# Altium project ESL_PCB_Project.PrjPCB
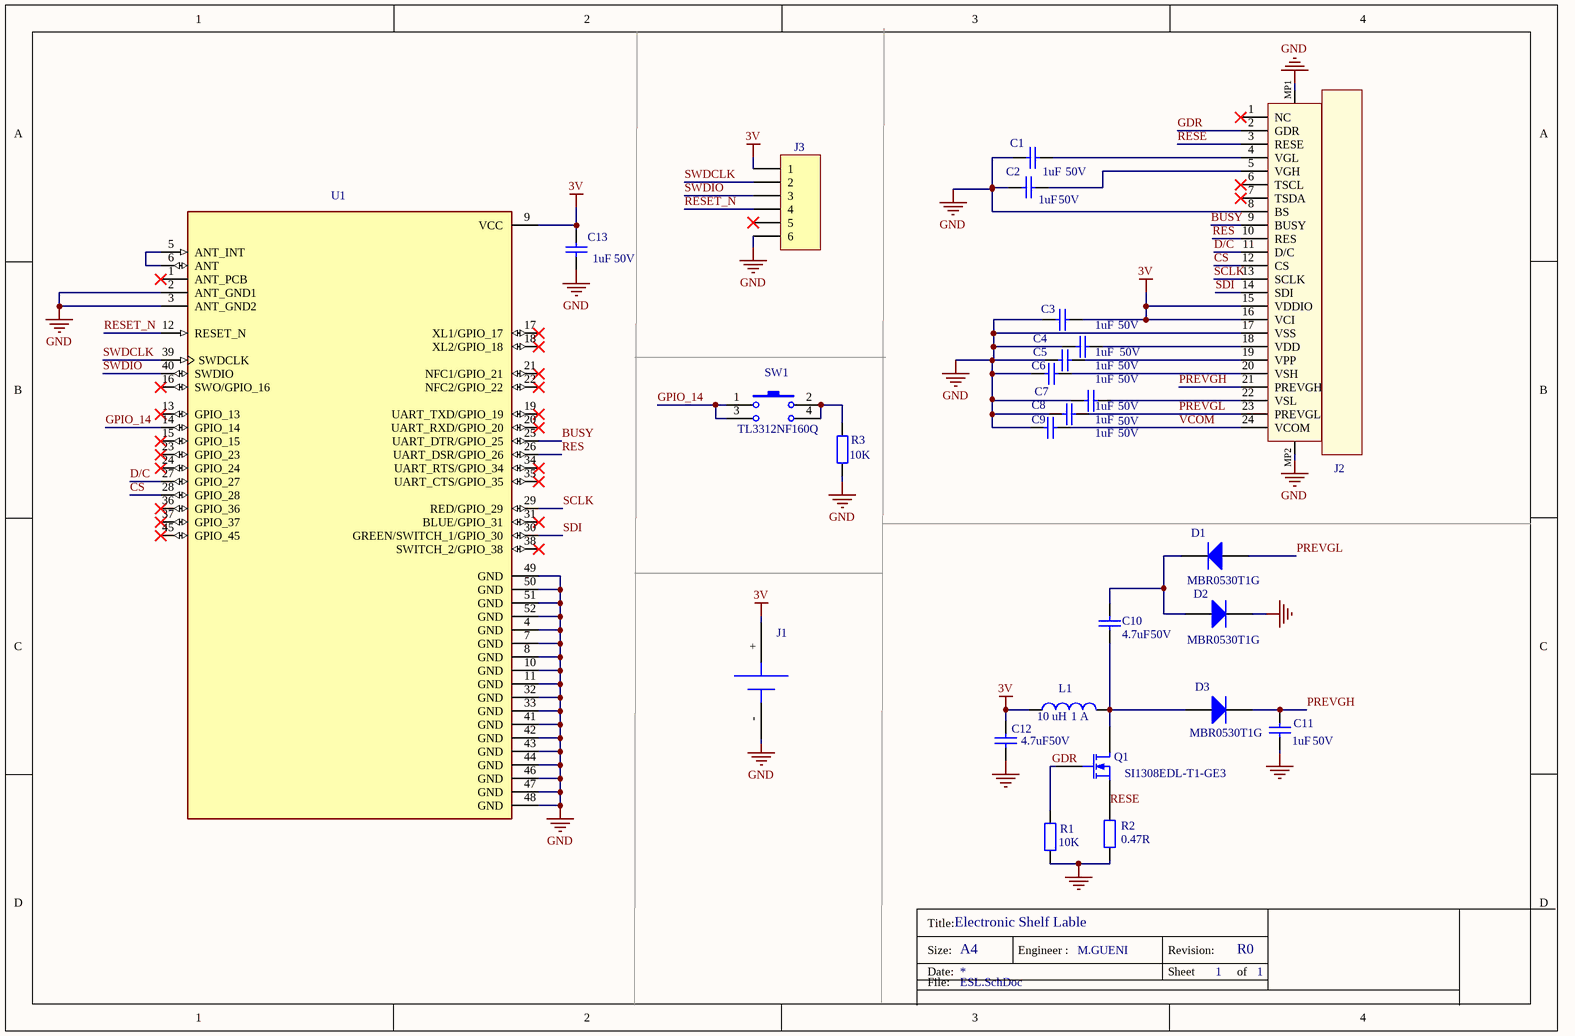
[diagram p0: ESL.SchDoc]
1 sheet, 26 parts. Net scope: global (net labels, ports and power ports of the same name join across sheets).
Board file: ESL.PcbDoc

## Sheet ESL.SchDoc
size A4; Organization: Micro Device Tunisie; Address1: Pépinière d’Entreprises Sousse-Tec; Address2: Espace Universitaire ISET SOUSSE; Address3: Cité Erriadh, 4023, Tunisia; Address4: contact@mdtunisie.com

### Parts
C1  Value 1: 1uF  Value 2: 50V  [CAPC1608N]  (hidden comment: Capacitor)
C2  Value 1: 1uF  Value 2: 50V  [CAPC1608N]  (hidden comment: Capacitor)
C3  Value 1: 1uF  Value 2: 50V  [CAPC1608N]  (hidden comment: Capacitor)
C4  Value 1: 1uF  Value 2: 50V  [CAPC1608N]  (hidden comment: Capacitor)
C5  Value 1: 1uF  Value 2: 50V  [CAPC1608N]  (hidden comment: Capacitor)
C6  Value 1: 1uF  Value 2: 50V  [CAPC1608N]  (hidden comment: Capacitor)
C7  Value 1: 1uF  Value 2: 50V  [CAPC1608N]  (hidden comment: Capacitor)
C8  Value 1: 1uF  Value 2: 50V  [CAPC1608N]  (hidden comment: Capacitor)
C9  Value 1: 1uF  Value 2: 50V  [CAPC1608N]  (hidden comment: Capacitor)
C10  Value 1: 4.7uF  Value 2: 50V  [CAPC2012N]  (hidden comment: Capacitor)
C11  Value 1: 1uF  Value 2: 50V  [CAPC1608N]  (hidden comment: Capacitor)
C12  Value 1: 4.7uF  Value 2: 50V  [CAPC2012N]  (hidden comment: Capacitor)
C13  Value 1: 1uF  Value 2: 50V  [CAPC1608N]  (hidden comment: Capacitor)
D1  MBR0530T1G  [DO-SOD-123]
D2  MBR0530T1G  [DO-SOD-123]
D3  MBR0530T1G  [DO-SOD-123]
J1  Battery_Holder  [Battery_Holder]  (value not drawn)
J2  WR-FPC  [WR-FPC-68712414022]  (value not drawn)
J3  282834-6  [282834-6]  (value not drawn)
L1  Value 1: 10 uH  Value 2: 1 A  [IND_2520]  (hidden comment: 1239AS-H-100M=P2)
Q1  SI1308EDL-T1-GE3  [MOS-SOT-323-3]
R1  Value 1: 10K  [RESC1608N]  (hidden comment: Resistor)
R2  Value 1: 0.47R  [RESC1608N]  (hidden comment: Resistor)
R3  Value 1: 10K  [RESC1608N]  (hidden comment: Resistor)
SW1  TL3312NF160Q  [SPST-TL3312NF160Q]
U1  ANNA-B112-01B  [ANNA-B112-01B]  (value not drawn)

### Nets
3V: C3.2 C12.2 C13.2 J1.+ J2.15(VDDIO) J2.16(VCI) J3.1 L1.1 U1.9(VCC)
GND: C1.1 C2.2 C3.1 C4.1 C5.1 C6.1 C7.1 C8.1 C9.1 C11.1 C12.1 C13.1 D2.2(K) J1.- J2.8(BS) J2.17(VSS) J2.MP1 J2.MP2 J3.6 R1.1 R2.1 R3.1 U1.2(ANT_GND1) U1.3(ANT_GND2) U1.4(GND) U1.7(GND) U1.8(GND) U1.10(GND) U1.11(GND) U1.32(GND) U1.33(GND) U1.41(GND) U1.42(GND) U1.43(GND) U1.44(GND) U1.46(GND) U1.47(GND) U1.48(GND) U1.49(GND) U1.50(GND) U1.51(GND) U1.52(GND)
BUSY: J2.9(BUSY) U1.25(UART_DTR/GPIO_25)
CS: J2.12(CS) U1.28(GPIO_28)
D/C: J2.11(D/C) U1.27(GPIO_27)
GDR: J2.2(GDR) Q1.1(G) R1.2
GPIO_14: SW1.1 SW1.3 U1.14(GPIO_14)
PREVGH: C11.2 D3.2(K) J2.21(PREVGH)
PREVGL: C8.2 D1.1(A) J2.23(PREVGL)
RES: J2.10(RES) U1.26(UART_DSR/GPIO_26)
RESE: J2.3(RESE) Q1.2(S) R2.2
RESET_N: J3.4 U1.12(RESET_N)
SCLK: J2.13(SCLK) U1.29(RED/GPIO_29)
SDI: J2.14(SDI) U1.30(GREEN/SWITCH_1/GPIO_30)
SWDCLK: J3.2 U1.39(SWDCLK)
SWDIO: J3.3 U1.40(SWDIO)
VCOM: C9.2 J2.24(VCOM)
NetC1_2: C1.2 J2.4(VGL)
NetC2_1: C2.1 J2.5(VGH)
NetC4_2: C4.2 J2.18(VDD)
NetC5_2: C5.2 J2.19(VPP)
NetC6_2: C6.2 J2.20(VSH)
NetC7_2: C7.2 J2.22(VSL)
NetC10_1: C10.1 D3.1(A) L1.2 Q1.3(D)
NetC10_2: C10.2 D1.2(K) D2.1(A)
NetR3_2: R3.2 SW1.2 SW1.4
NetU1_5: U1.5(ANT_INT) U1.6(ANT)

Not connected (* = marked no-connect by the designer): J2 1(NC)* 6(TSCL)* 7(TSDA)*; J3 5*; U1 1(ANT_PCB)* 13(GPIO_13)* 15(GPIO_15)* 16(SWO/GPIO_16)* 17(XL1/GPIO_17)* 18(XL2/GPIO_18)* 19(UART_TXD/GPIO_19)* 20(UART_RXD/GPIO_20)* 21(NFC1/GPIO_21)* 22(NFC2/GPIO_22)* 23(GPIO_23)* 24(GPIO_24)* 31(BLUE/GPIO_31)* 34(UART_RTS/GPIO_34)* 35(UART_CTS/GPIO_35)* 36(GPIO_36)* 37(GPIO_37)* 38(SWITCH_2/GPIO_38)* 45(GPIO_45)*

### Notes on the sheet
- Title:
- Size:
- Date:
- File:
- Electronic Shelf Lable
- A4
- Engineer :
- M.GUENI
- Revision:
- Sheet
- 1
- R0
- of

### Library data of the parts
C1-C9 C11 C13 = CAP-000000001: MAN: Taiyo Yuden; MANREF: UMK107BJ105KA-T; DES: Multilayer Ceramic Capacitors MLCC - SMD/SMT 1uF 50V X5R +/-10% 0603 Gen Purp; TOL: 10%; FTP: 0603; SUP: Mouser; SUPREF: 963-UMK107BJ105KA-T; NOTE: _; Part Number: CAP-000000001
C10 C12 = CAP-000000002: MAN: Murata Electronics; MANREF: GRM21BZ71H475KE15K; DES: Multilayer Ceramic Capacitors MLCC - SMD/SMT; TOL: 10%; FTP: 0805; SUP: Mouser; SUPREF: 81-GRM21BZ71H475KE5K; NOTE: _; Part Number: CAP-000000002
D1-D3 = DIR-000000001: Diode; MAN: ON Semiconductor; DES: Schottky Diodes & Rectifiers 0.5A 30V; Value 1: 500 mA; Value 2: 30 V; TOL: _; FTP: SOD-123; SUP: Mouser; SUPREF: 863-MBR0530T1G; Part Number: DIR-000000001; MANREF: MBR0530T1G; NOTE: _
J1 = CON-000000002: MAN: Keystone Electronics; MANREF: 3092; DES: Coin Cell Battery Holders 3012 matte Tin Coin Coin Cell Retainer; Value 1: _; Value 2: 16 mm; FTP: SMD/SMT; SUP: Mouser; SUPREF: 534-3092; Part Number: CON-000000002; TOL: _; NOTE: _
J2 = CON-000000001: MAN: Wurth Elektronik; MANREF: 68712414022; DES: FFC & FPC Connectors WR-FPC 0.5mm SMT ZIF 24Pin Hrztl Top Cont; Value 1: 24pts; Value 2: _; FTP: SMD/SMT; SUP: Mouser; SUPREF: 710-68712414022; ComponentLink1Description: Manufacturer; ComponentLink1URL: http://www.we-online.de; ComponentLink2Description: Datasheet; ComponentLink2URL: https://katalog.we-online.com/em/datasheet/68712414022.pdf; Part Number: CON-000000001; TOL: _; NOTE: _
J3 = CON-000000003: Header, 6-Pin; MAN: BUCHANAN - TE CONNECTIVITY; DES: 282834-6 -  Bornier fil-à-carte, 2.54 mm, 6 Voies, 30 AWG, 16 AWG, 1.4 mm², Par vis; Value 1: 6pts; Value 2: 2.54mm; TOL: _; FTP: THT; SUP: Farnell; SUPREF: 2396255; Part Number: CON-000000003; MANREF: 282834-6; NOTE: _
L1 = IND-000000001: Inductor; MAN: Murata Electronics; DES: Fixed Inductors 10.0uH 460mOhms1.0A +/-20% 2.5x2.0x1.2mm; TOL: 20 %; FTP: 2520; SUP: Mouser; SUPREF: 81-1239AS-H-100MP2; NOTE: _; Part Number: IND-000000001; MANREF: 1239AS-H-100M=P2
Q1 = TRM-000000001: MAN: Vishay Semiconductors; DES: MOSFET 30V Vds 12V Vgs SC70-3; Value 1: 1.5 A; Value 2: 30 V; TOL: _; FTP: SOT-323-3; SUP: Mouser; SUPREF: 78-SI1308EDL-T1-GE3; Part Number: TRM-000000001; MANREF: SI1308EDL-T1-GE3; NOTE: _
R1 R3 = RES-000000002: MAN: YAGEO; MANREF: RC0603FR-0710KL; DES: YAGEO (PHYCOMP)  RC0603FR-0710KL  RESISTANCE COUCHE EPAISSE 10K 0.1W 1%; Value 2: 0.1W; TOL: 1%; FTP: 0603; SUP: Farnell; SUPREF: 9238603; NOTE: _; Part Number: RES-000000002
R2 = RES-000000001: MAN: BOURNS; MANREF: CRL0603-FW-R470ELF; DES: CRL0603-FW-R470ELF -  Résistance à puce CMS, Couche épaisse, 0603 [1608 Metric], 0.47 ohm, Série CRL, Couche épaisse; Value 2: 0.1W; TOL: 1%; FTP: 0603; SUP: Farnell; SUPREF: 2328098; NOTE: _; Part Number: RES-000000001
SW1 = SWC-000000001: MAN: E-Switch; DES: Tactile Switches 50mA 12VDC .25mm H 160gf SPST 3.7x3.7mm; Value 1: _; SUP: Mouser; SUPREF: 612-TL3312NF160Q; Part Number: SWC-000000001; MANREF: TL3312NF160Q; Value 2: _; TOL: _; FTP: _; NOTE: _
U1 = RFC-000000001: MAN: U-Blox; DES: Bluetooth Bluetooth v5.0 Transceiver Module 2.4GHz Integrated, Chip Surface Mount; Value 1: _; SUP: Digi-Key; SUPREF: 672-ANNA-B112-01BTR-ND; MF: U-Blox America; Part Number: RFC-000000001; MANREF: ANNA-B112-01B; Value 2: _; TOL: _; FTP: _; NOTE: _; Price: None; Package: SMD-52 U-Blox America; SnapEDA_Link: https://www.snapeda.com/parts/ANNA-B112/U-Blox%20America%20Inc./view-part/3115089/?ref=snap; Value: *; MP: ANNA-B112; Availability: Unavailable